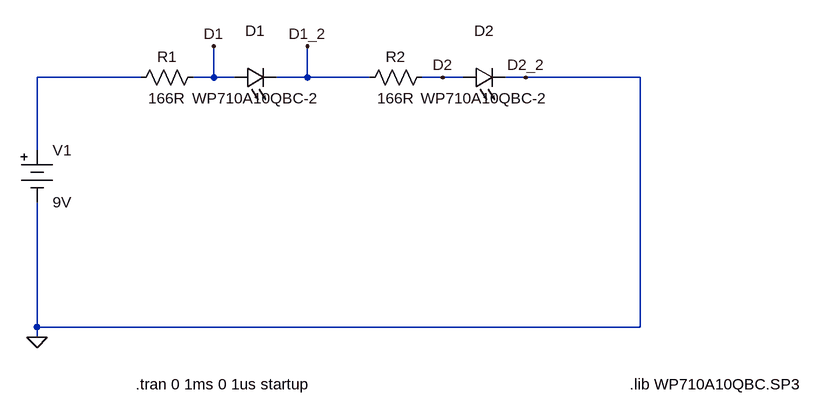
[diagram p0: schematic Draft1.asc]
Draft1.asc, the LTspice schematic file:
Version 4
SHEET 1 1104 680
WIRE 96 176 -64 176
WIRE 208 176 208 128
WIRE 208 176 176 176
WIRE 240 176 208 176
WIRE 352 176 352 128
WIRE 352 176 304 176
WIRE 448 176 352 176
WIRE 560 176 528 176
WIRE 592 176 560 176
WIRE 688 176 656 176
WIRE 864 176 688 176
WIRE -64 288 -64 176
WIRE -64 560 -64 368
WIRE 864 560 864 176
WIRE 864 560 -64 560
WIRE -64 576 -64 560
FLAG -64 576 0
FLAG 208 128 D1
FLAG 352 128 D1_2
FLAG 560 176 D2
FLAG 688 176 D2_2
SYMBOL Misc/battery -64 272 R0
SYMATTR InstName V1
SYMATTR Value 9V
SYMBOL res 192 160 R90
WINDOW 0 0 56 VBottom 2
WINDOW 3 32 56 VTop 2
SYMATTR InstName R1
SYMATTR Value 166R
SYMBOL LED 240 192 R270
WINDOW 0 72 32 VTop 2
WINDOW 3 0 32 VBottom 2
SYMATTR InstName D1
SYMATTR Value WP710A10QBC-2
SYMBOL res 544 160 R90
WINDOW 0 0 56 VBottom 2
WINDOW 3 32 56 VTop 2
SYMATTR InstName R2
SYMATTR Value 166R
SYMBOL LED 592 192 R270
WINDOW 0 72 32 VTop 2
WINDOW 3 0 32 VBottom 2
SYMATTR InstName D2
SYMATTR Value WP710A10QBC-2
TEXT 848 648 Left 2 !.lib WP710A10QBC.SP3
TEXT 88 648 Left 2 !.tran 0 1ms 0 1us startup

The netlist it stands for:
* Draft1.asc
V1 N001 0 9V
R1 D1 N001 166R
D1 D1 D1_2 WP710A10QBC-2
R2 D2 D1_2 166R
D2 D2 0 WP710A10QBC-2
.model D D
.lib standard.dio
.lib WP710A10QBC.SP3
.tran 0 1ms 0 1us startup
.backanno
.end